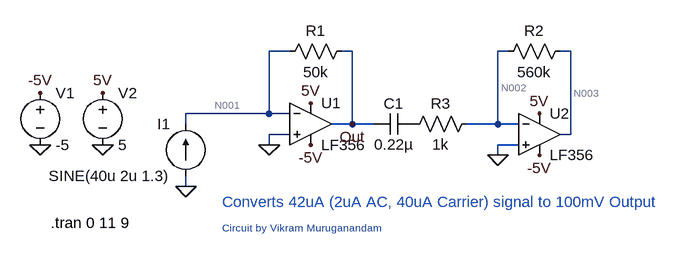
[diagram p0: schematic Stage2.asc]
Stage2.asc, the LTspice schematic file:
Version 4
SHEET 1 988 680
WIRE 336 64 304 64
WIRE 432 64 416 64
WIRE 672 64 656 64
WIRE 768 64 752 64
WIRE 304 160 304 64
WIRE 304 160 176 160
WIRE 336 160 304 160
WIRE 176 176 176 160
WIRE 432 176 432 64
WIRE 432 176 400 176
WIRE 464 176 432 176
WIRE 656 176 656 64
WIRE 656 176 608 176
WIRE 688 176 656 176
WIRE 336 192 304 192
WIRE 768 192 768 64
WIRE 768 192 752 192
WIRE 304 208 304 192
WIRE 688 208 656 208
WIRE 656 224 656 208
WIRE 176 272 176 256
FLAG -48 208 0
FLAG 48 208 0
FLAG 48 128 5V
FLAG 368 144 5V
FLAG -48 128 -5V
FLAG 368 208 -5V
FLAG 304 208 0
FLAG 176 272 0
FLAG 432 176 Out
FLAG 656 224 0
FLAG 720 224 -5V
FLAG 720 160 5V
SYMBOL voltage -48 112 R0
WINDOW 123 0 0 Left 0
WINDOW 39 0 0 Left 0
SYMATTR InstName V1
SYMATTR Value -5
SYMBOL voltage 48 112 R0
WINDOW 123 0 0 Left 0
WINDOW 39 0 0 Left 0
SYMATTR InstName V2
SYMATTR Value 5
SYMBOL LF356 368 112 R0
SYMATTR InstName U1
SYMBOL res 432 48 R90
WINDOW 0 0 56 VBottom 2
WINDOW 3 32 56 VTop 2
SYMATTR InstName R1
SYMATTR Value 50k
SYMBOL current 176 256 R180
WINDOW 0 24 80 Left 2
WINDOW 3 24 0 Left 2
WINDOW 123 0 0 Left 0
WINDOW 39 0 0 Left 0
SYMATTR InstName I1
SYMATTR Value SINE(40u 2u 1.3)
SYMBOL LF356 720 128 R0
SYMATTR InstName U2
SYMBOL res 768 48 R90
WINDOW 0 0 56 VBottom 2
WINDOW 3 32 56 VTop 2
SYMATTR InstName R2
SYMATTR Value 560k
SYMBOL cap 528 160 R90
WINDOW 0 0 32 VBottom 2
WINDOW 3 32 32 VTop 2
SYMATTR InstName C1
SYMATTR Value 0.22µ
SYMBOL res 624 160 R90
WINDOW 0 0 56 VBottom 2
WINDOW 3 32 56 VTop 2
SYMATTR InstName R3
SYMATTR Value 1k
TEXT -32 328 Left 2 !.tran 0 11 9
TEXT 232 296 Left 2 ;Converts 42uA (2uA AC, 40uA Carrier) signal to 100mV Output
TEXT 232 336 Left 1 ;Circuit by Vikram Muruganandam

The netlist it stands for:
* Stage2.asc
V1 -5V 0 -5
V2 5V 0 5
XU1 0 N001 5V -5V Out LF356  ; pins In+ In- V+ V- OUT
R1 Out N001 50k
I1 0 N001 SINE(40u 2u 1.3)
XU2 0 N002 5V -5V N003 LF356  ; pins In+ In- V+ V- OUT
R2 N003 N002 560k
C1 P001 Out 0.22µ
R3 N002 P001 1k
.tran 0 11 9
* Converts 42uA (2uA AC, 40uA Carrier) signal to 100mV Output
* Circuit by Vikram Muruganandam
.lib LF356.sub
.backanno
.end

* Results of the author's LTspice run, read from the files saved beside the schematic
* Operating Point, zero values left out:
*   V(-5v) = -5 V
*   V(5v) = 5 V
*   V(n001) = 3.01 mV
*   V(out) = -1.997 V
*   V(n002) = 3 mV
*   V(n003) = 3.021 mV
*   V(p001) = 3 mV
*   I(I1) = 40 µA
*   I(R1) = -40 µA
*   I(R2) = 37 pA
*   I(V1) = 9.74 mA
*   I(V2) = -9.7 mA
*   Ix(u1:1) = 31 pA
*   Ix(u1:2) = 37.01 pA
*   Ix(u1:99) = 4.85 mA
*   Ix(u1:50) = -4.89 mA
*   Ix(u1:28) = 40 µA
*   Ix(u2:1) = 31 pA
*   Ix(u2:2) = 37 pA
*   Ix(u2:99) = 4.85 mA
*   Ix(u2:50) = -4.85 mA
*   Ix(u2:28) = -37 pA
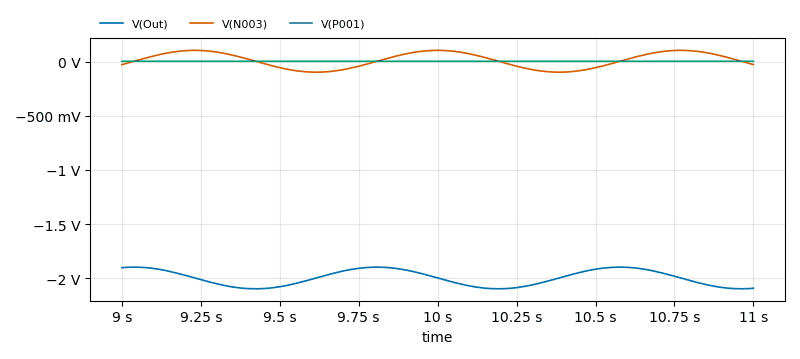
[diagram p1: Transient Analysis of Stage2.asc, plotted from the saved traces]
* Transient Analysis, 1 run:
*   V(Out): min -2.097 V, max -1.897 V, average -1.997 V, rms 1.998 V, last -2.092 V
*   V(N003): min -97.65 mV, max 103.6 mV, average 14.72 mV, rms 70.46 mV, last -27.9 mV
*   V(P001): min 2.82 mV, max 3.18 mV, average 2.979 mV, rms 2.982 mV, last 3.055 mV